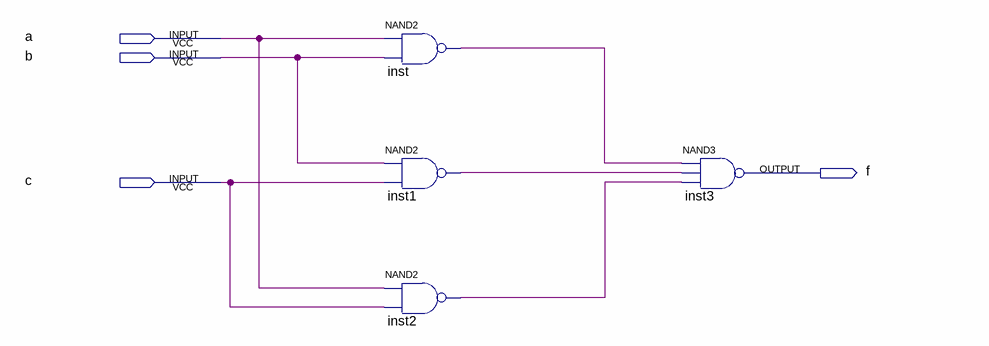
[diagram p0: schematic sheet]
// Quartus schematic biaojue.bdf as structural Verilog: 4 symbols, 4 pins
module biaojue (
  input  a,
  input  b,
  input  c,
  output f
);

  wire inst1_out, inst2_out, inst_out;

  nand inst (inst_out, a, b);
  nand inst1 (inst1_out, b, c);
  nand inst2 (inst2_out, a, c);
  nand inst3 (f, inst_out, inst1_out, inst2_out);
endmodule
